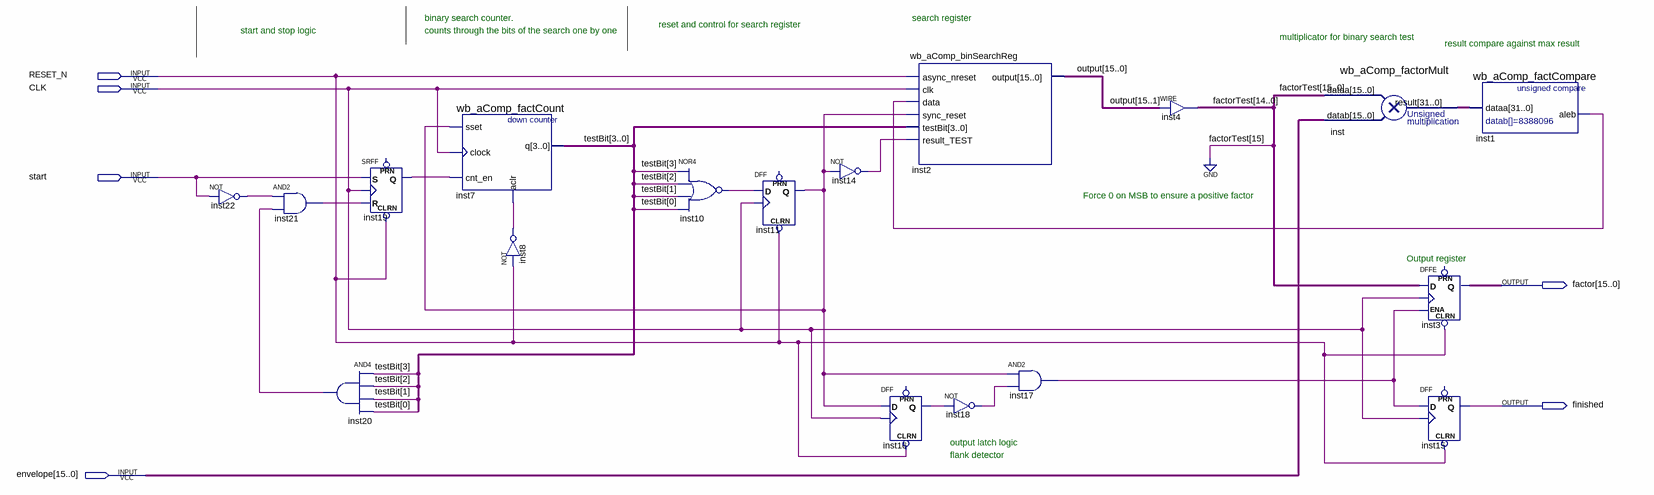
[diagram p0: schematic sheet]
// Quartus schematic wb_aComp_factorFinder.bdf as structural Verilog: 18 symbols, 6 pins
module wb_aComp_factorFinder (
  input  RESET_N,
  input  CLK,
  input  start,
  input  [15:0] envelope,
  output [15:0] factor,
  output finished
);

  wire inst1_aleb, inst8_out, inst10_out, inst11_q, inst14_out, inst16_q, inst17_out, inst18_out, inst19_q,
       inst20_out, inst21_out, inst22_out;
  wire [3:0] testBit;
  wire [14:0] factorTest;
  wire [15:0] \output ;
  wire [31:0] inst_result;

  not inst22 (inst22_out, start);
  and inst21 (inst21_out, inst22_out, inst20_out);
  and inst20 (inst20_out, testBit[3], testBit[2], testBit[1], testBit[0]);
  SRFF inst19 (.CLRN(RESET_N), .S(start), .R(inst21_out), .CLK(CLK), .Q(inst19_q));  // open: PRN
  wb_aComp_factCount inst7 (.sset(inst11_q), .clock(CLK), .cnt_en(inst19_q), .aclr(inst8_out), .q(testBit));
  not inst8 (inst8_out, RESET_N);
  nor inst10 (inst10_out, testBit[3], testBit[2], testBit[1], testBit[0]);
  DFF inst11 (.CLRN(RESET_N), .CLK(CLK), .D(inst10_out), .Q(inst11_q));  // open: PRN
  not inst14 (inst14_out, inst11_q);
  DFF inst16 (.CLRN(RESET_N), .CLK(CLK), .D(inst11_q), .Q(inst16_q));  // open: PRN
  wb_aComp_binSearchReg inst2 (
    .async_nreset(RESET_N), .clk(CLK), .data(inst1_aleb), .sync_reset(inst11_q), .testBit(testBit),
    .result_TEST(inst14_out), .\output (\output ));
  not inst18 (inst18_out, inst16_q);
  and inst17 (inst17_out, inst11_q, inst18_out);
  assign factorTest = \output [15:1];  // WIRE inst4
  wb_aComp_factorMult inst (.dataa({1'b0, factorTest}), .datab(envelope), .result(inst_result));
  DFFE inst3[15:0] (.CLRN(RESET_N), .D({1'b0, factorTest}), .CLK(CLK), .ENA(inst17_out), .Q(factor));  // open: PRN
  DFF inst15 (.CLRN(RESET_N), .CLK(CLK), .D(inst17_out), .Q(finished));  // open: PRN
  wb_aComp_factCompare inst1 (.dataa(inst_result), .aleb(inst1_aleb));

  // Notes on the sheet:
  //   binary search counter.
  //   search register
  //   reset and control for search register
  //   start and stop logic
  //   counts through the bits of the search one by one
  //   multiplicator for binary search test
  //   result compare against max result
  //   Force 0 on MSB to ensure a positive factor
  //   Output register
  //   output latch logic
  //   flank detector
endmodule
